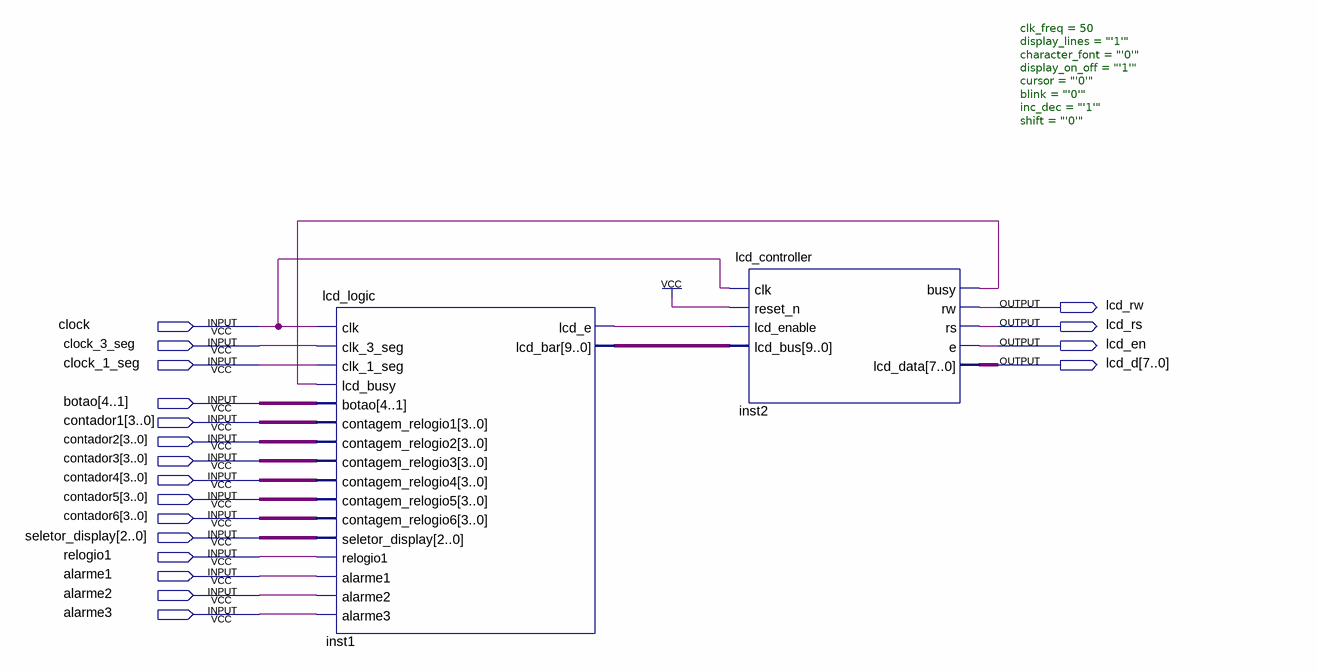
[diagram p0: schematic sheet]
// Quartus schematic LCD.bdf as structural Verilog: 2 symbols, 19 pins
module LCD (
  input  clock,
  input  clock_3_seg,
  input  clock_1_seg,
  input  [4:1] botao,
  input  [3:0] contador1,
  input  [3:0] contador2,
  input  [3:0] contador3,
  input  [3:0] contador4,
  input  [3:0] contador5,
  input  [3:0] contador6,
  input  [2:0] seletor_display,
  input  relogio1,
  input  alarme1,
  input  alarme2,
  input  alarme3,
  output lcd_rw,
  output lcd_rs,
  output lcd_en,
  output [7:0] lcd_d
);

  wire inst1_lcd_e, inst2_busy;
  wire [9:0] inst1_lcd_bar;

  lcd_logic inst1 (
    .clk(clock), .clk_3_seg(clock_3_seg), .clk_1_seg(clock_1_seg), .lcd_busy(inst2_busy), .botao(botao),
    .contagem_relogio1(contador1), .contagem_relogio2(contador2), .contagem_relogio3(contador3),
    .contagem_relogio4(contador4), .contagem_relogio5(contador5), .contagem_relogio6(contador6),
    .seletor_display(seletor_display), .relogio1(relogio1), .alarme1(alarme1), .alarme2(alarme2),
    .alarme3(alarme3), .lcd_e(inst1_lcd_e), .lcd_bar(inst1_lcd_bar));
  lcd_controller #(.clk_freq(50), .display_lines("'1'"), .character_font("'0'"), .display_on_off("'1'"), .cursor("'0'"), .blink("'0'"), .inc_dec("'1'"), .shift("'0'")) inst2 (
    .clk(clock), .reset_n(1'b1), .lcd_enable(inst1_lcd_e), .lcd_bus(inst1_lcd_bar), .busy(inst2_busy),
    .rw(lcd_rw), .rs(lcd_rs), .e(lcd_en), .lcd_data(lcd_d));
endmodule
